# Altium schematic sheet FilterBoard.Schematic.SchDoc
size B
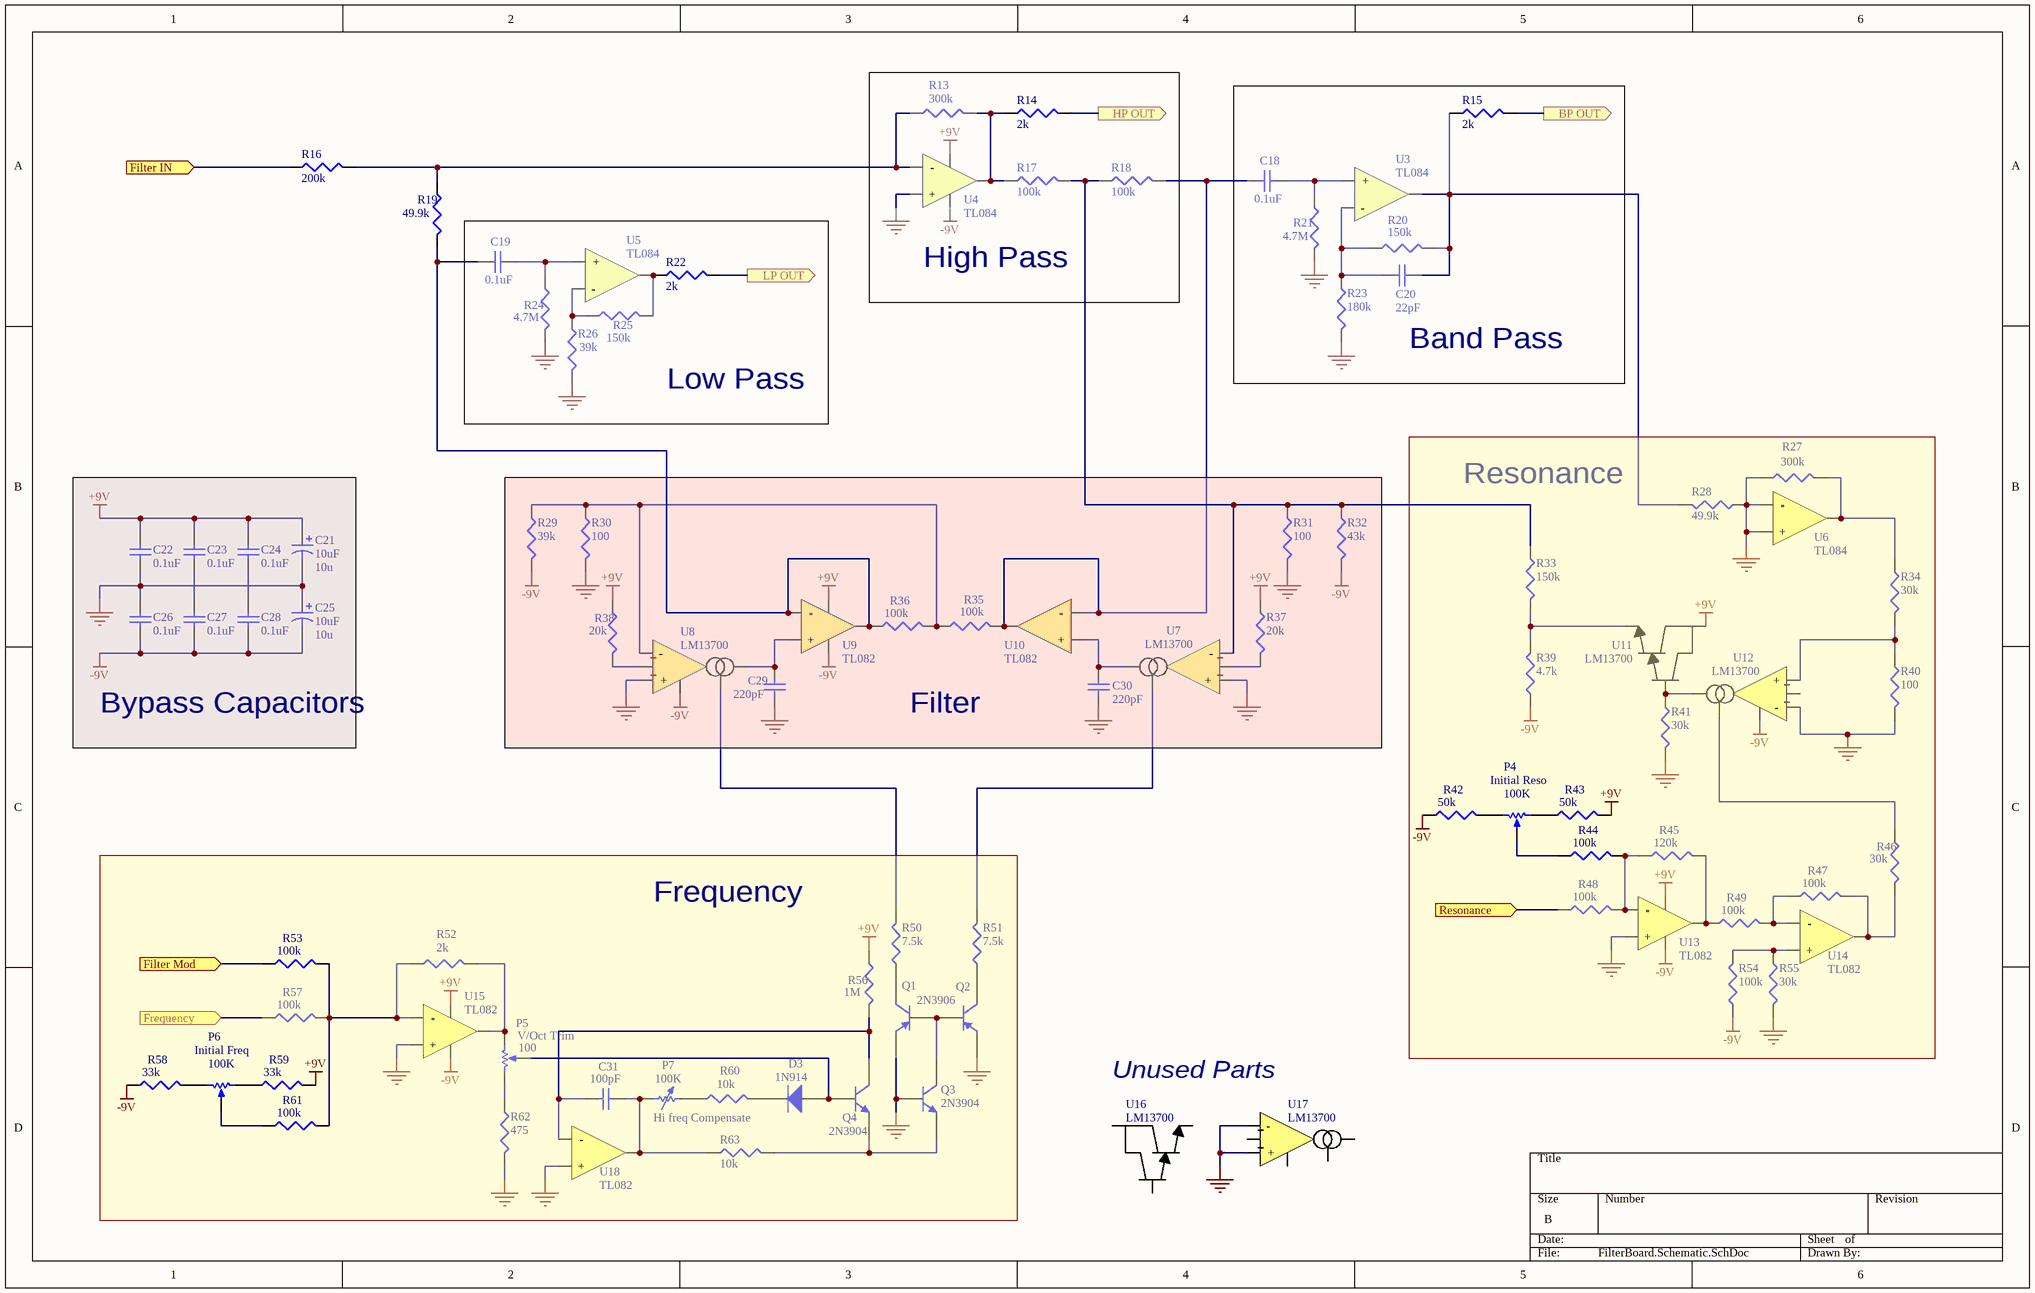
[diagram p0: FilterBoard.Schematic.SchDoc]

## Parts
C18  0.1uF  [CAPC1608N]
C19  0.1uF  [CAPC1608N]
C20  22pF  [CAPC1608N]
C21  10uF  value 10u  [RB7.6-15]
C22  0.1uF  [CAPC1608N]
C23  0.1uF  [CAPC1608N]
C24  0.1uF  [CAPC1608N]
C25  10uF  value 10u  [RB7.6-15]
C26  0.1uF  [CAPC1608N]
C27  0.1uF  [CAPC1608N]
C28  0.1uF  [CAPC1608N]
C29  220pF  [CAPC1608N]
C30  220pF  [CAPC1608N]
C31  100pF  [CAPC1608N]
D3  1N914  [1N914]
P4  Initial Reso  value 100K  [VR5]
P5  V/Oct Trim  value 100  [VR5]
P6  Initial Freq  value 100K  [VR5]
P7  Hi freq Compensate  value 100K  [CAPC1608N]
Q1  2N3906  [2N3906]
Q2  2N3906  [2N3906]  (value not drawn)
Q3  2N3904  [TO-92A]
Q4  2N3904  [TO-92A]
R13  300k  [CAPC1608N]
R14  2k  [CAPC1608N]
R15  2k  [CAPC1608N]
R16  200k  [CAPC1608N]
R17  100k  [CAPC1608N]
R18  100k  [CAPC1608N]
R19  49.9k  [CAPC1608N]
R20  150k  [CAPC1608N]
R21  4.7M  [CAPC1608N]
R22  2k  [CAPC1608N]
R23  180k  [CAPC1608N]
R24  4.7M  [CAPC1608N]
R25  150k  [CAPC1608N]
R26  39k  [CAPC1608N]
R27  300k  [CAPC1608N]
R28  49.9k  [CAPC1608N]
R29  39k  [CAPC1608N]
R30  100  [CAPC1608N]
R31  100  [CAPC1608N]
R32  43k  [CAPC1608N]
R33  150k  [CAPC1608N]
R34  30k  [CAPC1608N]
R35  100k  [CAPC1608N]
R36  100k  [CAPC1608N]
R37  20k  [CAPC1608N]
R38  20k  [CAPC1608N]
R39  4.7k  [CAPC1608N]
R40  100  [CAPC1608N]
R41  30k  [CAPC1608N]
R42  50k  [CAPC1608N]
R43  50k  [CAPC1608N]
R44  100k  [CAPC1608N]
R45  120k  [CAPC1608N]
R46  30k  [CAPC1608N]
R47  100k  [CAPC1608N]
R48  100k  [CAPC1608N]
R49  100k  [CAPC1608N]
R50  7.5k  [CAPC1608N]
R51  7.5k  [CAPC1608N]
R52  2k  [CAPC1608N]
R53  100k  [CAPC1608N]
R54  100k  [CAPC1608N]
R55  30k  [CAPC1608N]
R56  1M  [CAPC1608N]
R57  100k  [CAPC1608N]
R58  33k  [CAPC1608N]
R59  33k  [CAPC1608N]
R60  10k  [CAPC1608N]
R61  100k  [CAPC1608N]
R62  475  [CAPC1608N]
R63  10k  [CAPC1608N]
U3  TL084
U4  TL084
U5  TL084
U6  TL084
U7  LM13700  [LM13700]
U8  LM13700  [LM13700]
U9  TL082  [TL084]
U10  TL082  [TL084]
U11  LM13700
U12  LM13700  [LM13700]
U13  TL082  [TL084]
U14  TL082  [TL084]
U15  TL082  [TL084]
U16  LM13700
U17  LM13700  [LM13700]
U18  TL082  [TL084]

## Blocks framed on the sheet
High Pass: R13 R14 R17 R18 U4
Band Pass: C18 C20 R15 R20 R21 R23 U3
Low Pass: C19 R22 R24-R26 U5
Resonance: P4 R27 R28 R33 R34 R39-R49 R54 R55 U6 U11-U14
Bypass Capacitors: C21-C28
Filter: C29 C30 R29-R32 R35-R38 U7-U10
Frequency: C31 D3 P5-P7 Q1-Q4 R50-R53 R56-R63 U15 U18

## Ports
BP OUT (out), Filter IN (in), Filter Mod (in), Frequency (in), HP OUT (out), LP OUT (out), Resonance (in)

## Nets
+9V: C21.1 C22.2 C23.2 C24.2 R37.1 R38.1 R43.2 R56.1 R59.2 U4.4(VCC+) U9.8(VCC+) U11.11(V+) U13.8(VCC+) U15.8(VCC+)
-9V: C25.2 C26.1 C27.1 C28.1 R29.2 R32.2 R39.1 R42.1 R54.1 R58.1 U4.11(VCC-) U8.6(VCC-) U9.4(VCC-) U12.6(VCC-) U13.4(VCC-) U15.4(VCC-)
GND: C21.2 C22.1 C25.1 C26.2 C29.1 C30.1 Q1.1(E) Q2.1(E) Q3.2(B) R21.2 R23.2 R24.2 R26.2 R27.1 R28.1 R30.2 R31.2 R40.2 R41.2 R55.2 R62.2 U4.3(+) U6.12(-) U6.13(+) U7.3(+) U8.3(+) U12.3(-) U13.3(+) U15.3(+) U17.3(+) U17.4(-) U18.5(+)
BP OUT: R15.2 ; port BP OUT
Filter IN: R16.1 ; port Filter IN
Filter Mod: R53.1 ; port Filter Mod
Frequency: R57.1 ; port Frequency
HP OUT: R14.2 ; port HP OUT
LP OUT: R22.2 ; port LP OUT
Resonance: R48.1 ; port Resonance
NetC18_1: C18.1 R18.2 R35.2 U10.6(-) U10.7(OUT)
NetC18_2: C18.2 R21.1 U3.5(+)
NetC19_1: C19.1 R19.2 R36.1 U9.1(OUT) U9.2(-)
NetC19_2: C19.2 R24.1 U5.5(+)
NetC20_1: C20.1 R20.1 R23.1 U3.3(-)
NetC20_2: C20.2 R15.1 R20.2 R28.2 U3.7(OUT)
NetC23_1: C23.1 C27.2
NetC24_1: C24.1 C28.2
NetC29_2: C29.2 U8.5(OUT) U9.3(+)
NetC30_2: C30.2 U7.5(OUT) U10.5(+)
NetC31_1: C31.1 Q4.3(C) R56.2 U18.6(-)
NetC31_2: C31.2 P7.1 R63.1 U18.7(OUT)
NetD3_1: D3.1(A) P5.3(TAP) Q4.2(B)
NetD3_2: D3.2(K) R60.2
NetP4_1: P4.1(TOP) R43.1
NetP4_2: P4.2(BOT) R42.2
NetP4_3: P4.3(TAP) R44.1
NetP5_1: P5.1(TOP) R52.2 U15.1(OUT)
NetP5_2: P5.2(BOT) R62.1
NetP6_1: P6.1(TOP) R59.1
NetP6_2: P6.2(BOT) R58.2
NetP6_3: P6.3(TAP) R61.1
NetP7_2: P7.2 R60.1
NetQ1_2: Q1.2(B) Q2.2(B) Q3.3(C)
NetQ1_3: Q1.3(C) R50.1
NetQ2_3: Q2.3(C) R51.1
NetQ3_1: Q3.1(E) Q4.1(E) R63.2
NetR13_1: R13.1 R16.2 R19.1 U4.2(-)
NetR13_2: R13.2 R14.1 R17.1 U4.1(OUT)
NetR17_2: R17.2 R18.1 R31.1 R32.1 R33.1 U7.4(-)
NetR22_1: R22.1 R25.2 U5.7(OUT)
NetR25_1: R25.1 R26.1 U5.3(-)
NetR27_2: R27.2 R34.1 U6.14(OUT)
NetR29_1: R29.1 R30.1 R35.1 R36.2 U8.4(-)
NetR33_2: R33.2 R39.2 U11.8(BOUT)
NetR34_2: R34.2 R40.1 U12.4(+)
NetR37_2: R37.2 U7.2
NetR38_2: R38.2 U8.2
NetR41_1: R41.1 U11.7(BIN) U12.5(OUT)
NetR44_2: R44.2 R45.1 R48.2 U13.2(-)
NetR45_2: R45.2 R49.1 U13.1(OUT)
NetR46_1: R46.1 U12.1(BIAS)
NetR46_2: R46.2 R47.2 U14.7(OUT)
NetR47_1: R47.1 R49.2 U14.6(-)
NetR50_2: R50.2 U8.1(BIAS)
NetR51_2: R51.2 U7.1(BIAS)
NetR52_1: R52.1 R53.2 R57.2 R61.2 U15.2(-)
NetR54_2: R54.2 R55.1 U14.5(+)

Not connected (* = marked no-connect by the designer): U3 6(VCC+) 11(VCC-); U5 6(VCC+) 11(VCC-); U6 1(VCC+) 11(VCC-); U7 6(VCC-); U10 4(VCC-) 8(VCC+); U12 2; U14 4(VCC-) 8(VCC+); U16 7(BIN) 8(BOUT) 11(V+); U17 1(BIAS) 2 5(OUT) 6(VCC-); U18 4(VCC-) 8(VCC+)

## Notes on the sheet
- Unused Parts

## Library data of the parts
C18 C19 C22-C24 C26-C28 = Cap Semi: Capacitor (Semiconductor SIM Model); Value: 0.1u; Published: 8-Jun-2000; LatestRevisionDate: 29-May-2009; LatestRevisionNote: IPC-7351 Footprint Added.; PackageReference: C1206; Publisher: Altium Limited; PackageDescription: Chip Capacitor
C20 = Cap Semi: Capacitor (Semiconductor SIM Model); Value: 22p; Published: 8-Jun-2000; LatestRevisionDate: 29-May-2009; LatestRevisionNote: IPC-7351 Footprint Added.; PackageReference: C1206; Publisher: Altium Limited; PackageDescription: Chip Capacitor
C21 C25 = Cap Pol1: Polarized Capacitor (Radial); Published: 8-Jun-2000; LatestRevisionDate: 17-Jul-2002; LatestRevisionNote: Re-released for DXP Platform.; PackageReference: RB7.6-15; Publisher: Altium Limited; PackageDescription: Polarized Capacitor (Radial); 2 Leads
C29 C30 = Cap Semi: Capacitor (Semiconductor SIM Model); Value: 220p; Published: 8-Jun-2000; LatestRevisionDate: 29-May-2009; LatestRevisionNote: IPC-7351 Footprint Added.; PackageReference: C1206; Publisher: Altium Limited; PackageDescription: Chip Capacitor
C31 = Cap Semi: Capacitor (Semiconductor SIM Model); Value: 100p; Published: 8-Jun-2000; LatestRevisionDate: 29-May-2009; LatestRevisionNote: IPC-7351 Footprint Added.; PackageReference: C1206; Publisher: Altium Limited; PackageDescription: Chip Capacitor
D3 = Diode 1N4001: 1 Amp General Purpose Rectifier; Published: 8-Jun-2000; LatestRevisionDate: 17-Jul-2002; LatestRevisionNote: Re-released for DXP Platform.; DatasheetVersion: 1998; PackageVersion: Aug-1999; PackageReference: DO-41; Publisher: Altium Limited; PackageDescription: Diode, Axial; Body 5.2 x 2.7 mm (LxDia. max), Lead Dia. 0.86 mm (max); Code_JEDEC: DO-204-AL; ComponentLink1Description: Manufacturer Link; ComponentLink1URL: http://www.fairchildsemi.com/; ComponentLink2Description: Datasheet; ComponentLink2URL: http://www.fairchildsemi.com/ds/1N%2F1N4001.pdf
P4-P6 = RPot: Potentiometer; Sim Note: Enter the Resistance value and the set point into parameter fields.; Set Position: 0.5; Published: 8-Jun-2000; LatestRevisionDate: 17-Jul-2002; LatestRevisionNote: Re-released for DXP Platform.; PackageReference: VR5; Publisher: Altium Limited; PackageDescription: Variable Resistor, Thru-Hole; 3 Leads
P7 = Res Adj1: Variable Resistor; Set Position: 0.5; Published: 8-Jun-2000; LatestRevisionDate: 17-Jul-2002; LatestRevisionNote: Re-released for DXP Platform.; PackageReference: AXIAL-0.7; Publisher: Altium Limited; PackageDescription: Axial Device, Thru-Hole; 2 Leads; 0.7 in Pin Spacing
Q1 Q2 = 2N3906: PNP General Purpose Amplifier; Published: 8-Jun-2000; LatestRevisionDate: 15-Jan-2003; LatestRevisionNote: PCB Footprint 'BCY-W3/D4.7' replaced; DatasheetVersion: 1997; PackageVersion: Sep-1998; PackageReference: TO-92A; Publisher: Altium Limited; PackageDescription: TO, Flat Index; 3 In-Line, Axial Leads; Body Dia. 4.5mm; Leads 0.51 x 0.48 mm (max); ComponentLink1Description: Manufacturer Link; ComponentLink1URL: http://www.fairchildsemi.com/; ComponentLink2Description: Datasheet; ComponentLink2URL: http://www.fairchildsemi.com/ds/2N%2F2N3906.pdf
Q3 Q4 = 2N3904: NPN General Purpose Amplifier; Published: 8-Jun-2000; LatestRevisionDate: 15-Jan-2003; LatestRevisionNote: PCB Footprint 'BCY-W3/D4.7' replaced; DatasheetVersion: 1997; PackageVersion: Sep-1998; PackageReference: TO-92A; Publisher: Altium Limited; PackageDescription: TO, Flat Index; 3 In-Line, Axial Leads; Body Dia. 4.5mm; Leads 0.51 x 0.48 mm (max); ComponentLink1Description: Manufacturer Link; ComponentLink1URL: http://www.fairchildsemi.com/; ComponentLink2Description: Datasheet; ComponentLink2URL: http://www.fairchildsemi.com/ds/2N%2F2N3904.pdf
R13-R63 = Res3: Resistor; Published: 8-Jun-2000; LatestRevisionDate: 29-May-2009; LatestRevisionNote: IPC-7351 Footprint Added.; PackageReference: J1-0603; Publisher: Altium Limited; PackageDescription: Chip Resistor
  R13 R27: Value: 300K
  R14 R15 R22 R52: Value: 2K
  R16: Value: 200K
  R17 R18 R35 R36 R44 R47-R49 R53 R54 R57 R61: Value: 100K
  R19 R28: Value: 49.9K
  R20 R25 R33: Value: 150K
  R21 R24: Value: 4.7M
  R23: Value: 180K
  R26 R29: Value: 39K
  R30 R31 R40: Value: 100
  R32: Value: 43K
  R34 R41 R46 R55: Value: 30K
  R37 R38: Value: 20K
  R39: Value: 4.7K
  R42 R43: Value: 50K
  R45: Value: 120K
  R50 R51: Value: 7.5K
  R56: Value: 1M
  R58 R59: Value: 33K
  R60 R63: Value: 10K
  R62: Value: 475
U11 U16 = LM13700_1